# Altium project SB10012_UniversalSlave.PrjPcb
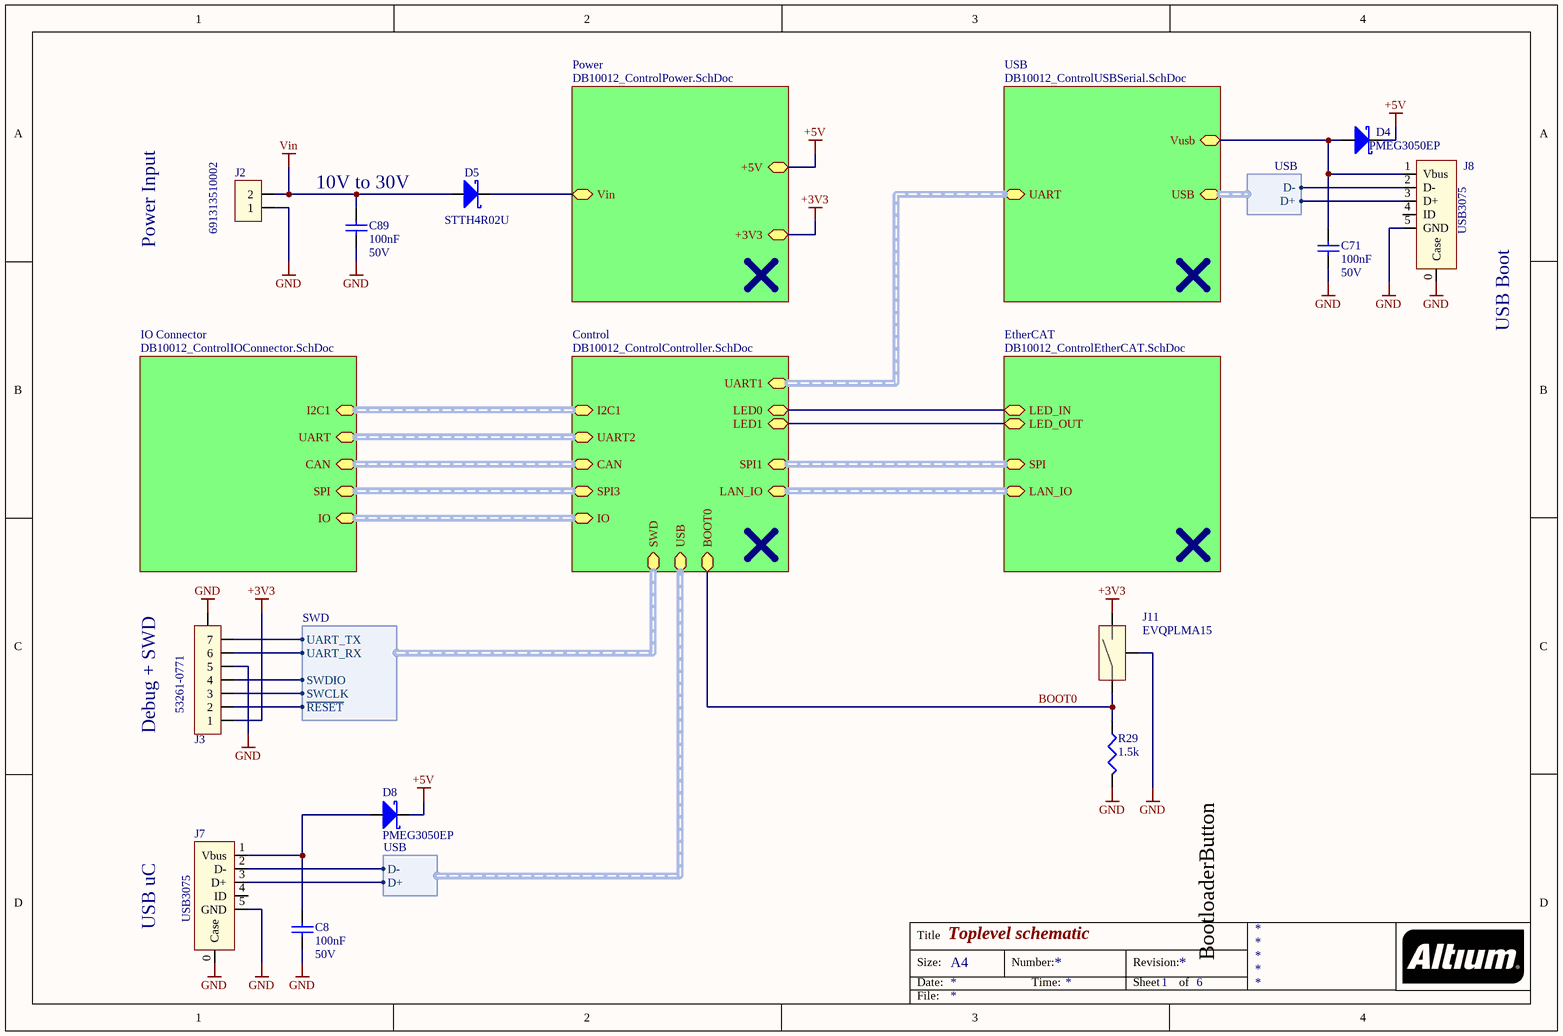
[diagram p0: DB10012_ControlTopLevel.SchDoc]
6 sheets, 148 parts. Net scope: hierarchical (ports join the sheet entries above them; power ports are global).
Board file: DB10012_UniversalSlave.PcbDoc
Sheets:
  DB10012_ControlTopLevel.SchDoc
    EtherCAT = DB10012_ControlEtherCAT.SchDoc
    Control = DB10012_ControlController.SchDoc
    USB = DB10012_ControlUSBSerial.SchDoc
    Power = DB10012_ControlPower.SchDoc
    IO Connector = DB10012_ControlIOConnector.SchDoc

## Sheet DB10012_ControlTopLevel.SchDoc: Toplevel schematic
size A4; SheetNumber: 1; SheetTotal: 6

### Parts
C8  100nF  Voltage Rating: 50V  [C-0805]
C71  100nF  Voltage Rating: 50V  [C-0805]
C89  100nF  Voltage Rating: 50V  [C-0805]
D4  PMEG3050EP  [SOD128]
D5  STTH4R02U  [CASE 403A-03]
D8  PMEG3050EP  [SOD128]
J2  691313510002  [691313510002]
J3  53261-0771  [53261-0771]
J7  USB3075  [USB3075 - NOSLOT]
J8  USB3075  [USB3075 - NOSLOT]
J11  EVQPLMA15  [EVQPLM]
R29  1.5k  [0402]

### Sub-sheets
Control = DB10012_ControlController.SchDoc: SPI1 (harness SPI), LAN_IO (harness LAN_IO), UART1 (harness UART), SPI3 (harness SPI), I2C1 (harness I2C1), CAN (harness CAN), UART2 (harness UART), IO (harness IO), USB (harness USB), SWD (harness SWD), BOOT0, LED0, LED1
EtherCAT = DB10012_ControlEtherCAT.SchDoc: SPI (harness SPI), LAN_IO (harness LAN_IO), LED_IN, LED_OUT
IO Connector = DB10012_ControlIOConnector.SchDoc: SPI (harness SPI), I2C1 (harness I2C1), CAN (harness CAN), IO (harness IO), UART (harness UART)
Power = DB10012_ControlPower.SchDoc: +5V, +3V3, Vin
USB = DB10012_ControlUSBSerial.SchDoc: UART (harness UART), USB (harness USB), Vusb

### Harnesses
SWD: UART_TX, UART_RX, SWDIO, SWCLK, ~{RESET}
USB: D-, D+

### Nets
+3V3: J3.1 J11.2 ; sheet Power/+3V3
+5V: D4.2(K) D8.2(K) ; sheet Power/+5V
GND: C8.1 C71.1 C89.1 J2.1 J3.0(SHLD) J3.5 J7.0(Case) J7.5(GND) J8.0(Case) J8.5(GND) J11.0(GND) R29.1
Vin: C89.2 D5.1(A) J2.2
BOOT0: J11.1 R29.2 ; sheet Control/BOOT0
~{Reset}: J3.2 ; sheet Control/SWD.~{RESET}
SWCLK: J3.3 ; sheet Control/SWD.SWCLK
SWDIO: J3.4 ; sheet Control/SWD.SWDIO
UART1_RX: J3.6 ; sheet Control/SWD.UART_RX
UART1_TX: J3.7 ; sheet Control/SWD.UART_TX
USB_D+: J7.3(D+) ; sheet Control/USB.D+
USB_D-: J7.2(D-) ; sheet Control/USB.D-
NetC2_2: D5.2(K) ; sheet Power/Vin
NetC8_2: C8.2 D8.1(A) J7.1(Vbus)
NetC17_2: C71.2 D4.1(A) J8.1(Vbus) ; sheet USB/Vusb
NetIC5_3: J8.3(D+) ; sheet USB/USB.D+
NetIC5_4: J8.2(D-) ; sheet USB/USB.D-
NetR32_1: sheet EtherCAT/LED_IN, sheet Control/LED0
NetR33_1: sheet EtherCAT/LED_OUT, sheet Control/LED1

Not connected (* = marked no-connect by the designer): J7 4(ID); J8 4(ID)

### Buses and harness runs
harness sheet Control/CAN = sheet IO Connector/CAN
harness sheet Control/I2C1 = sheet IO Connector/I2C1
harness sheet Control/IO = sheet IO Connector/IO
harness sheet Control/LAN_IO = sheet EtherCAT/LAN_IO
harness sheet Control/SPI1 = sheet EtherCAT/SPI
harness sheet Control/SPI3 = sheet IO Connector/SPI
harness sheet Control/UART1 = sheet USB/UART
harness sheet Control/UART2 = sheet IO Connector/UART

### Notes on the sheet
- Power Input
- (near C89) 10V to 30V
- USB Boot
- (near J3) Debug + SWD
- BootloaderButton
- USB uC
- Title
- Size:
- Date:
- A4
- Number:
- Time:
- Revision:
- Sheet
- of
- File:

### Library data of the parts
C8 C71 C89 = 100nF/0805/CER/50V: Capacitor, 100nF, 50V,  X7R; Capacitance Tolerance: ± 10%; Capacitor Case Style: 0805; Brand Number: C0805C104K5RACTU; Brand: KEMET; Dielectric Characteristic: X7R; Capacitance: 100nF; Temperature Range: -55°C to +125°C; Price: 0,022; Order Code Supplier: 1414664; Supplier: Farnell
D4 D8 = PMEG3050EP: Diode Schottky, Vrrm: 30V, If: 3A, Vf: 0.36V; Brand: NXP; Case Style: SOD-128; Forward Current: 5A; Brand Number: PMEG3050EP; Forward Voltage: 0.36V; Order Code Supplier: 1829197; Price: 0,25; Supplier: Farnell; Temperature Range: -55°C to +150°C; Vrrm: 30V
D5 = STTH4R02U: Diode Schottky, Vrrm: 200V, If: 4A, Vf: 1,05V; Brand: STMICROELECTRONICS; Case Style: SMB; Forward Current: 3A; Forward Voltage: 1,05V; Brand Number: STTH4R02U; Order Code Supplier: 1295277; Price: 1,09; Supplier: Farnell; Temperature Range: -65°C to +150°C; Vrrm: 200V
J2 = 691313510002: WR-TBL 313 Series, 2 Contacts, Header, 5.08 mm; Brand: Wurth; Pitch: 5.08mm; Brand Number: 691313510002; Case Style: WR-TBL 313 Series; Order Code Supplier: 1641993; Price: 0,343; Supplier: Farnell
J3 = 53261-0771: PicoBlade 53261 Series, 7Pin, Right Angle; Brand: Molex; Pitch: 1,25mm; Brand Number: 53261-0771; Case Style: 53261-0771; Order Code Supplier: 1125361; Price: 1,80; Supplier: Farnell
J7 J8 = USB3075: USB 2.0 MICRO B, RCPT, 5POS, SMT; Brand: Global Connector Technology; Brand Number: USB3075-30-A; Case Style: Micro B SMT; Pitch: 0.8mm; Order Code Supplier: 2443116; Price: 0,313; Supplier: Farnell
J11 = EVQPLMA15: SWITCH, TACT, 4.9MM, SMD, 2.6N; Brand: PANASONIC ELECTRONIC COMPONENTS; Brand Number: EVQPLMA15; Price: 0,169; Order Code Supplier: 2079484; Supplier: Farnell
R29 = 1.5k/0402/0063W/50V: Resistor, 1.5k, 0.1%, 0.0625W, 50V, 100PPM, 0402; Brand: VISHAY DRALORIC; Brand Number: CRCW04021K50FKED; Power Rating: 0.063W; Case Style: 0402; Order Code Supplier: 2121624; Price: 0,0054; Resistance: 1.5k; Supplier: Farnell; Temperature Coefficient: ± 100PPM; Temperature Range: -55°C to +125°C; Voltage Rating: 50V

## Sheet DB10012_ControlEtherCAT.SchDoc: EtherCAT tranceiver
size A2; SheetNumber: 4; SheetTotal: 6
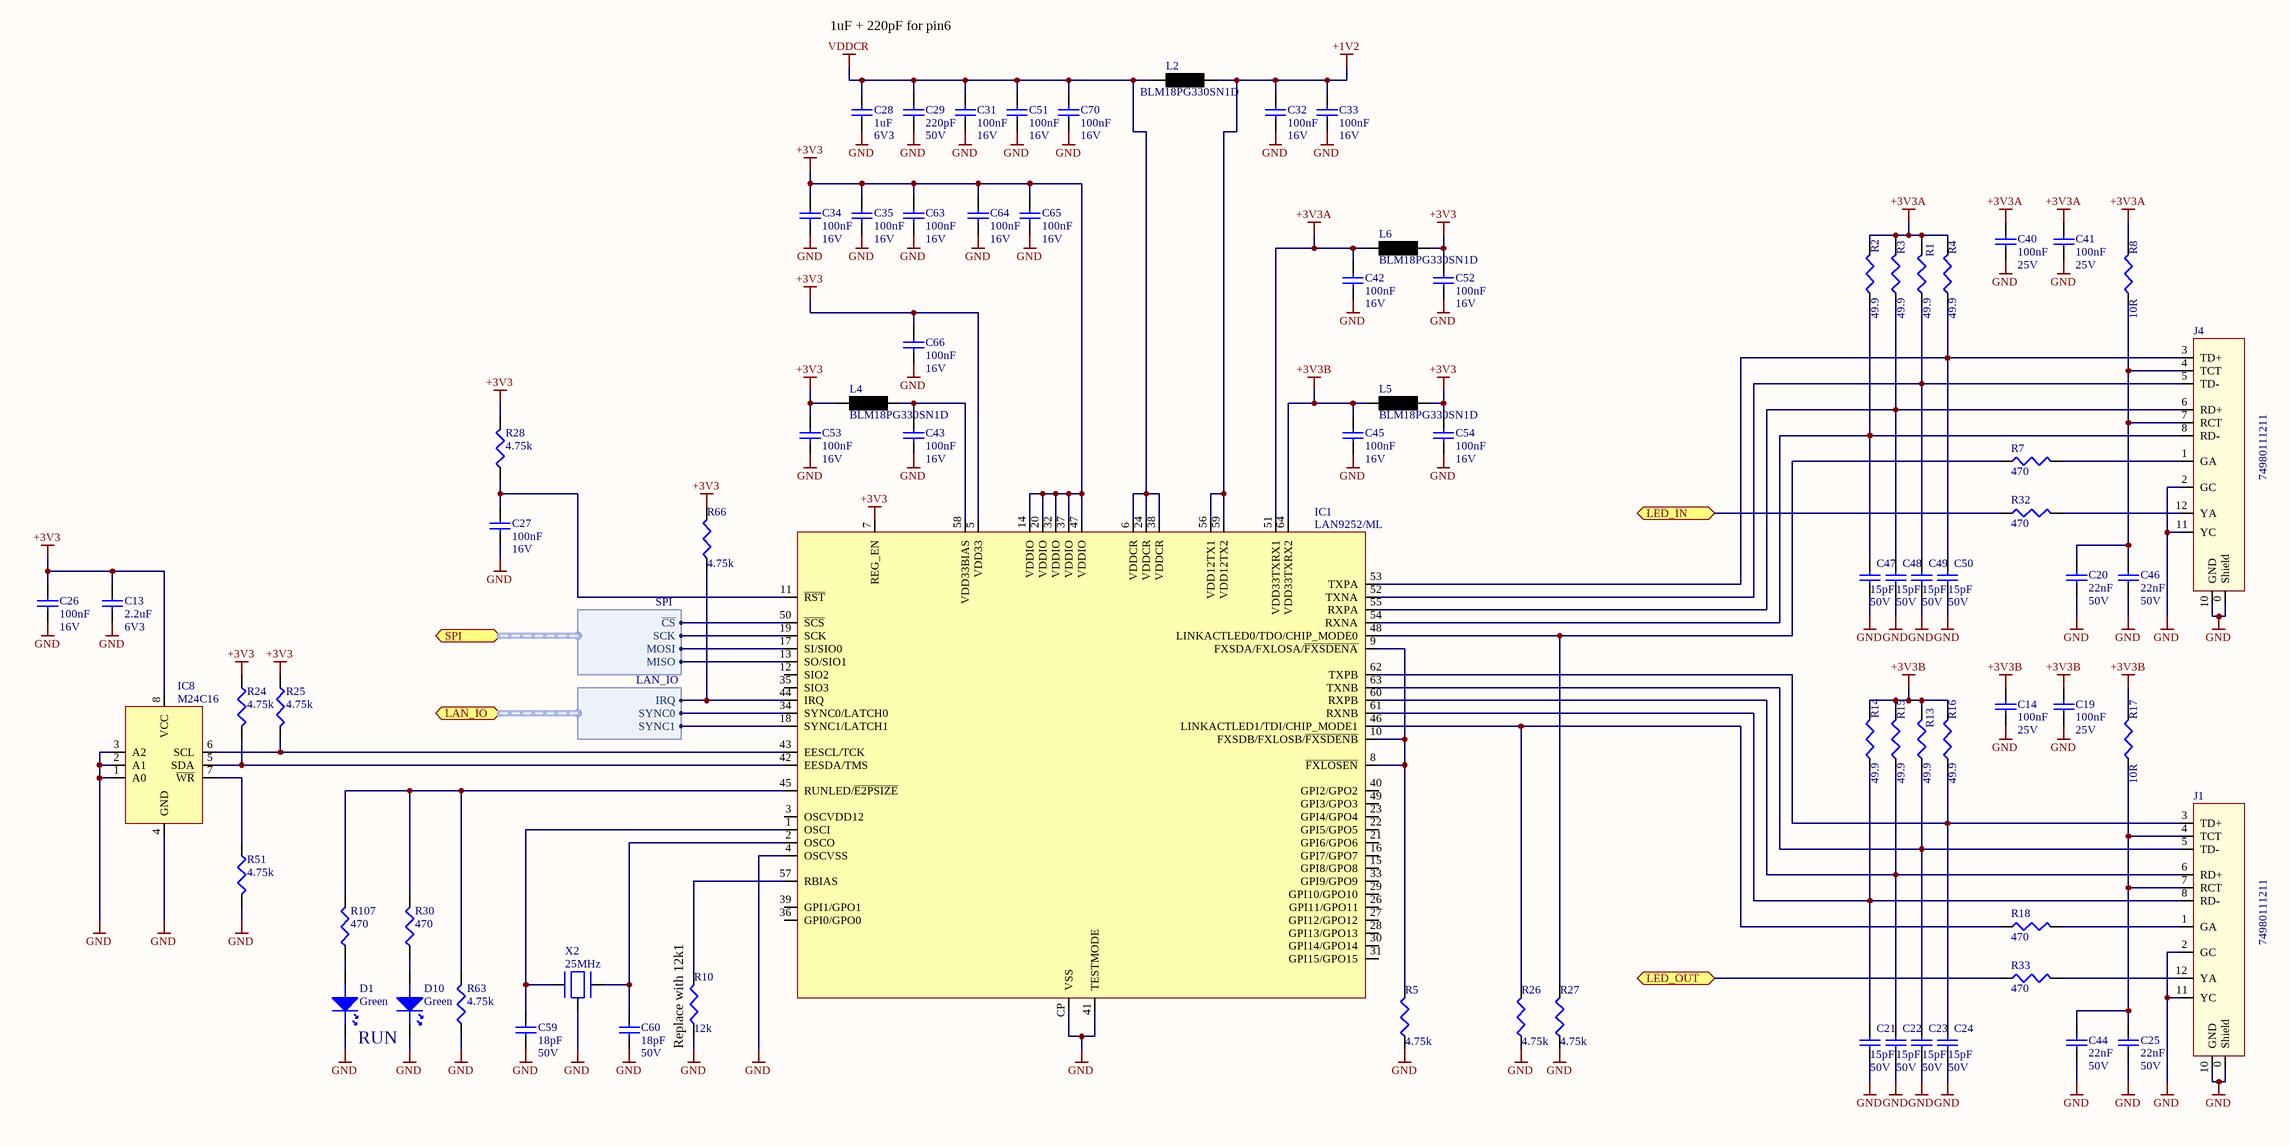
[diagram p1: DB10012_ControlEtherCAT.SchDoc]

### Parts
C13  2.2uF  Voltage Rating: 6V3  [C0402]
C14  100nF  Voltage Rating: 25V  [C0402]
C19  100nF  Voltage Rating: 25V  [C0402]
C20  22nF  Voltage Rating: 50V  [C0402]
C21  15pF  Voltage Rating: 50V  [C0402]
C22  15pF  Voltage Rating: 50V  [C0402]
C23  15pF  Voltage Rating: 50V  [C0402]
C24  15pF  Voltage Rating: 50V  [C0402]
C25  22nF  Voltage Rating: 50V  [C0402]
C26  100nF  Voltage Rating: 16V  [C0402]
C27  100nF  Voltage Rating: 16V  [C0402]
C28  1uF  Voltage Rating: 6V3  [C0402]
C29  220pF  Voltage Rating: 50V  [C0402]
C31  100nF  Voltage Rating: 16V  [C0402]
C32  100nF  Voltage Rating: 16V  [C0402]
C33  100nF  Voltage Rating: 16V  [C0402]
C34  100nF  Voltage Rating: 16V  [C0402]
C35  100nF  Voltage Rating: 16V  [C0402]
C40  100nF  Voltage Rating: 25V  [C0402]
C41  100nF  Voltage Rating: 25V  [C0402]
C42  100nF  Voltage Rating: 16V  [C0402]
C43  100nF  Voltage Rating: 16V  [C0402]
C44  22nF  Voltage Rating: 50V  [C0402]
C45  100nF  Voltage Rating: 16V  [C0402]
C46  22nF  Voltage Rating: 50V  [C0402]
C47  15pF  Voltage Rating: 50V  [C0402]
C48  15pF  Voltage Rating: 50V  [C0402]
C49  15pF  Voltage Rating: 50V  [C0402]
C50  15pF  Voltage Rating: 50V  [C0402]
C51  100nF  Voltage Rating: 16V  [C0402]
C52  100nF  Voltage Rating: 16V  [C0402]
C53  100nF  Voltage Rating: 16V  [C0402]
C54  100nF  Voltage Rating: 16V  [C0402]
C59  18pF  Voltage Rating: 50V  [C0402]
C60  18pF  Voltage Rating: 50V  [C0402]
C63  100nF  Voltage Rating: 16V  [C0402]
C64  100nF  Voltage Rating: 16V  [C0402]
C65  100nF  Voltage Rating: 16V  [C0402]
C66  100nF  Voltage Rating: 16V  [C0402]
C70  100nF  Voltage Rating: 16V  [C0402]
D1  Green  [D-0805]
D10  Green  [D-0805]
IC1  LAN9252/ML  [QFN64_Rect]
IC8  M24C16  [SO-8]
J1  74980111211  [74980111211]
J4  74980111211  [74980111211]
L2  BLM18PG330SN1D  [L0603]
L4  BLM18PG330SN1D  [L0603]
L5  BLM18PG330SN1D  [L0603]
L6  BLM18PG330SN1D  [L0603]
R1  49.9  [0402]
R2  49.9  [0402]
R3  49.9  [0402]
R4  49.9  [0402]
R5  4.75k  [0402]
R7  470  [0402]
R8  10R  [0603]
R10  12k  [0402]
R13  49.9  [0402]
R14  49.9  [0402]
R15  49.9  [0402]
R16  49.9  [0402]
R17  10R  [0603]
R18  470  [0402]
R24  4.75k  [0402]
R25  4.75k  [0402]
R26  4.75k  [0402]
R27  4.75k  [0402]
R28  4.75k  [0402]
R30  470  [0402]
R32  470  [0402]
R33  470  [0402]
R51  4.75k  [0402]
R63  4.75k  [0402]
R66  4.75k  [0402]
R107  470  [0402]
X2  25MHz  [7M]

### Ports
LAN_IO (harness LAN_IO), LED_IN, LED_OUT, SPI (harness SPI)

### Harnesses
SPI: SCK, ~{CS}, MOSI, MISO
LAN_IO: IRQ, SYNC0, SYNC1

### Nets
+1V2: C32.2 C33.2 IC1.56(VDD12TX1) IC1.59(VDD12TX2) L2.2
+3V3: C13.2 C26.2 C34.2 C35.2 C52.2 C53.2 C54.2 C63.2 C64.2 C65.2 C66.2 IC1.5(VDD33) IC1.7(REG_EN) IC1.14(VDDIO) IC1.20(VDDIO) IC1.32(VDDIO) IC1.37(VDDIO) IC1.47(VDDIO) IC8.8(VCC) L4.2 L5.2 L6.2 R24.2 R25.2 R28.2 R66.2
+3V3A: C40.2 C41.2 C42.2 IC1.51(VDD33TXRX1) L6.1 R1.2 R2.2 R3.2 R4.2 R8.2
+3V3B: C14.2 C19.2 C45.2 IC1.64(VDD33TXRX2) L5.1 R13.2 R14.2 R15.2 R16.2 R17.2
GND: C13.1 C14.1 C19.1 C20.1 C21.1 C22.1 C23.1 C24.1 C25.1 C26.1 C27.1 C28.1 C29.1 C31.1 C32.1 C33.1 C34.1 C35.1 C40.1 C41.1 C42.1 C43.1 C44.1 C45.1 C46.1 C47.1 C48.1 C49.1 C50.1 C51.1 C52.1 C53.1 C54.1 C59.1 C60.1 C63.1 C64.1 C65.1 C66.1 C70.1 D1.K D10.K IC1.4(OSCVSS) IC1.41(TESTMODE) IC1.CP(VSS) IC8.1(A0) IC8.2(A1) IC8.3(A2) IC8.4(GND) J1.0(Shield) J1.2(GC) J1.10(GND) J1.11(YC) J4.0(Shield) J4.2(GC) J4.10(GND) J4.11(YC) R5.1 R10.1 R26.1 R27.1 R51.1 R63.1 X2.0
VDDCR: C28.2 C29.2 C31.2 C51.2 C70.2 IC1.6(VDDCR) IC1.24(VDDCR) IC1.38(VDDCR) L2.1
LAN_IRQ: IC1.44(IRQ) R66.1 ; port LAN_IO.IRQ
LAN_SYNC0: IC1.34(SYNC0/LATCH0) ; port LAN_IO.SYNC0
LAN_SYNC1: IC1.18(SYNC1/LATCH1) ; port LAN_IO.SYNC1
SPI1_~{CS}: IC1.50(~{SCS}) ; port SPI.~{CS}
SPI1_MISO: IC1.13(SO/SIO1) ; port SPI.MISO
SPI1_MOSI: IC1.17(SI/SIO0) ; port SPI.MOSI
SPI1_SCK: IC1.19(SCK) ; port SPI.SCK
NetC20_2: C20.2 C46.2 J4.4(TCT) J4.7(RCT) R8.1
NetC21_2: C21.2 IC1.61(RXNB) J1.8(RD-) R14.1
NetC22_2: C22.2 IC1.60(RXPB) J1.6(RD+) R15.1
NetC23_2: C23.2 IC1.63(TXNB) J1.5(TD-) R13.1
NetC24_2: C24.2 IC1.62(TXPB) J1.3(TD+) R16.1
NetC25_2: C25.2 C44.2 J1.4(TCT) J1.7(RCT) R17.1
NetC27_2: C27.2 IC1.11(~{RST}) R28.1
NetC43_2: C43.2 IC1.58(VDD33BIAS) L4.1
NetC47_2: C47.2 IC1.54(RXNA) J4.8(RD-) R2.1
NetC48_2: C48.2 IC1.55(RXPA) J4.6(RD+) R3.1
NetC49_2: C49.2 IC1.52(TXNA) J4.5(TD-) R1.1
NetC50_2: C50.2 IC1.53(TXPA) J4.3(TD+) R4.1
NetC59_2: C59.2 IC1.1(OSCI) X2.1
NetC60_2: C60.2 IC1.2(OSCO) X2.2
NetD1_A: D1.A R107.1
NetD10_A: D10.A R30.1
NetIC1_8: IC1.8(~{FXLOSEN}) IC1.9(FXSDA/FXLOSA/~{FXSDENA}) IC1.10(FXSDB/FXLOSB/~{FXSDENB}) R5.2
NetIC1_42: IC1.42(EESDA/TMS) IC8.5(SDA) R24.1
NetIC1_43: IC1.43(EESCL/TCK) IC8.6(SCL) R25.1
NetIC1_45: IC1.45(RUNLED/~{E2PSIZE}) R30.2 R63.2 R107.2
NetIC1_46: IC1.46(LINKACTLED1/TDI/CHIP_MODE1) R18.1 R26.2
NetIC1_48: IC1.48(LINKACTLED0/TDO/CHIP_MODE0) R7.1 R27.2
NetIC1_57: IC1.57(RBIAS) R10.2
NetIC8_7: IC8.7(~{WR}) R51.2
NetJ1_1: J1.1(GA) R18.2
NetJ1_12: J1.12(YA) R33.2
NetJ4_1: J4.1(GA) R7.2
NetJ4_12: J4.12(YA) R32.2
NetR32_1: R32.1 ; port LED_IN
NetR33_1: R33.1 ; port LED_OUT

Not connected (* = marked no-connect by the designer): IC1 3(OSCVDD12) 12(SIO2) 15(GPI8/GPO8) 16(GPI7/GPO7) 21(GPI6/GPO6) 22(GPI5/GPO5) 23(GPI4/GPO4) 26(GPI11/GPO11) 27(GPI12/GPO12) 28(GPI13/GPO13) 29(GPI10/GPO10) 30(GPI14/GPO14) 31(GPI15/GPO15) 33(GPI9/GPO9) 35(SIO3) 36(GPI0/GPO0) 39(GPI1/GPO1) 40(GPI2/GPO2) 49(GPI3/GPO3)

### Notes on the sheet
- 1uF + 220pF for pin6
- RUN
- (near R10) Replace with 12k1
- Title
- Size:
- Date:
- File:
- A2
- Number:
- Time:
- Revision:
- Sheet
- of

### Library data of the parts
C13 = 2.2uF/0402/CER/6.3V: Capacitor, 2.2uF, 6.3V, X5R; Capacitance Tolerance: ± 10%; Capacitor Case Style: 0402; Brand Number: GRM155R60J225ME15D; Brand: MURATA; Dielectric Characteristic: X5R; Capacitance: 2.2uF; Temperature Range: -55°C to +85°C; Price: 0,818; Order Code Supplier: 2362088; Supplier: Farnell
C14 C19 C40 C41 = 100nF/0402/CER/25V: Capacitor, 100nF, 25V, X7R; Capacitance Tolerance: 10nF; Capacitor Case Style: 0402; Brand Number: GRM155R71E104KE14D; Brand: MULTICOMP; Dielectric Characteristic: X7R; Capacitance: 100nF; Temperature Range: -55 to +125 C; Price: 0,0225; Order Code Supplier: 2456106; Supplier: Farnell
C20 C25 C44 C46 = 22nF/0402/CER/50V: Capacitor, 22nF, 50V, X7R; Capacitance Tolerance: ± 5%; Capacitor Case Style: 0402; Brand Number: GRM155R71H223KA12D; Brand: Murata; Dielectric Characteristic: X7R; Capacitance: 22nF; Temperature Range: -55°C to 125°C; Price: 0,0133; Order Code Supplier: 1828888; Supplier: Farnell
C21-C24 C47-C50 = 15pF/0402/CER/50V: Capacitor, 15pF, 50V, C0G; Capacitance Tolerance: ± 5%; Capacitor Case Style: 0402; Brand Number: GRM1555C1H150JA01D; Brand: Murata; Dielectric Characteristic: C0G; Capacitance: 15pF; Temperature Range: -55°C to 125°C; Price: 0,0097; Order Code Supplier: 2218840; Supplier: Farnell
C26 C27 C31-C35 C42 C43 C45 C51-C54 C63-C66 C70 = 100nF/0402/CER/16V: Capacitor, 100nF, 16V, X7R; Capacitance Tolerance: 10nF; Capacitor Case Style: 0402; Brand Number: GRM155R71C104KA88D; Brand: MURATA; Dielectric Characteristic: X7R; Capacitance: 100nF; Temperature Range: -55 to +125 C; Price: 0,001; Order Code Supplier: 2408523; Supplier: Farnell
C28 = 1uF/0402/CER/6.3V: Capacitor, 1uF, 6.3V, X5R; Capacitance Tolerance: ± 10%; Capacitor Case Style: 0402; Brand Number: 04026D105KAT2A; Brand: AVX; Dielectric Characteristic: X5R; Capacitance: 1uF; Temperature Range: -55°C to +85°C; Price: 0,0874; Order Code Supplier: 1327658; Supplier: Farnell
C29 = 220pF/0402/CER/50V: Capacitor, 220pF, 50V, NP0; Capacitance Tolerance: ± 5%; Capacitor Case Style: 0402; Brand Number: GRM1555C1H221JA01D; Brand: MURATA; Dielectric Characteristic: NP0; Capacitance: 220pF; Temperature Range: -55°C to 125°C; Price: 0,02; Order Code Supplier: 8819580; Supplier: Farnell
C59 C60 = 18pF/0402/CER/50V: Capacitor, 18pF, 50V, NP0; Capacitance Tolerance: ± 5%; Capacitor Case Style: 0402; Brand Number: GRM1555C1H180JA01D; Brand: MURATA; Dielectric Characteristic: NP0; Capacitance: 18pF; Temperature Range: -55°C to 125°C; Price: 0,0177; Order Code Supplier: 1828876; Supplier: Farnell
D1 D10 = KP-2012SGC: Led, Green, Li:12mcd, Vf:2.2V, If:0.02A; Brand: KingBright; Case Style: 0805; Forward Current: 0.02A; Forward Voltage: 2.2V; Luminous Intensity: 12mcd; Brand Number: KP-2012SGC; Order Code Supplier: 1318243; Price: 0,06; Supplier: Farnell; Temperature Range: -30°C to +85°C
IC1 = LAN9252/ML: EtherCAT Slave Controller; Brand: Microchip; Case Style: QFN64; Brand Number: LAN9252/ML; Order Code Supplier: 579-LAN9252/ML; Price: 7,23; Supplier: Mouser; Temperature Range: -55°C to +155°C
IC8 = M24C16-WMN6P: SERIAL EEPROM, 16KBIT, 400KHZ; Brand: ST Micro; Case Style: SO8; Brand Number: M24C16-WMN6P; Order Code Supplier: 9882774; Price: 0,811; Supplier: Farnell; Temperature Range: -55°C to +155°C
J1 J4 = 74980111211: RJ45 With LAN TRANSFRMR; Brand: Wurth; Case Style: SMT RJ45; Brand Number: 74980111211; Order Code Supplier: 2407403; Pitch: -; Price: 9,36; Supplier: Farnell
L2 L4-L6 = BLM18PG330SN1D: Ferrite Bead, Impedance:33ohm, DC Resistance Max:0.025ohm, DC Current Rating:3A; Brand: MURATA; Case Style: 0603; Brand Number: BLM18PG330SN1D; Order Code Supplier: 1515742; Price: 0,048; Supplier: Farnell
R1-R4 R13-R16 = 49.9/0402/0063W/50V: Resistor, 49.9, 0.1%, 0.0625W, 50V, 100PPM, 0402; Brand: VISHAY DRALORIC; Brand Number: CRCW040249R9FKED; Power Rating: 0.063W; Case Style: 0402; Order Code Supplier: 2121437; Price: 0,0004; Resistance: 49.9; Supplier: Farnell; Temperature Coefficient: ± 100PPM; Temperature Range: -55°C to +125°C; Voltage Rating: 50V
R5 R24-R28 R51 R63 R66 = 4.75k/0402/0063W/50V: Resistor, 4.75k, 0.1%, 0.0625W, 50V, 100PPM, 0402; Brand: VISHAY DRALORIC; Brand Number: CRCW04024K75FKED; Power Rating: 0.063W; Case Style: 0402; Order Code Supplier: 2121689; Price: 0,0006; Resistance: 4.75k; Supplier: Farnell; Temperature Coefficient: ± 100PPM; Temperature Range: -55°C to +125°C; Voltage Rating: 50V
R7 R18 R30 R32 R33 R107 = 470/0402/0063W/50V: Resistor, 470, 1%, 0.0625W, 50V, 100PPM, 0402; Brand: VISHAY DRALORIC; Brand Number: CRG0402F470R; Power Rating: 0.063W; Case Style: 0402; Order Code Supplier: 2331533; Price: 0,0099; Resistance: 470; Supplier: Farnell; Temperature Coefficient: ± 100PPM; Temperature Range: -55°C to +125°C; Voltage Rating: 50V
R8 R17 = 10/0603/0125W/50V: Resistor, 10R, 1%, 0.125W, 50V, 200PPM, 0603; Brand: MULTICOMP; Brand Number: MCHP03W8F100JT5E; Case Style: 0603; Order Code Supplier: 1576250; Power Rating: 0.125W; Price: 0,08; Resistance: 10R; Supplier: Farnell; Temperature Coefficient: ± 200PPM; Temperature Range: -55°C to +155°C; Voltage Rating: 50V
R10 = 12k/0402/0063W/50V: Resistor, 12k, 1%, 0.0625W, 50V, 100PPM, 0402; Brand: TE CONNECTIVITY; Brand Number: CRG0402F12K; Power Rating: 0.063W; Case Style: 0402; Order Code Supplier: 2331453; Price: 0,0075; Resistance: 12k; Supplier: Farnell; Temperature Coefficient: ± 100PPM; Temperature Range: -55°C to +125°C; Voltage Rating: 50V
X2 = 7M-25.000MAAJ-T: CRYSTAL, 25MHz,18PF CL, 3.2X2.5MM SMT; Brand: TXC; Price: 0,995; Supplier: Farnell; Order Code Supplier: 1842068; Brand Number: 7M-25.000MAAJ-T

## Sheet DB10012_ControlController.SchDoc: Microcontroller
size A3; SheetNumber: 5; SheetTotal: 6
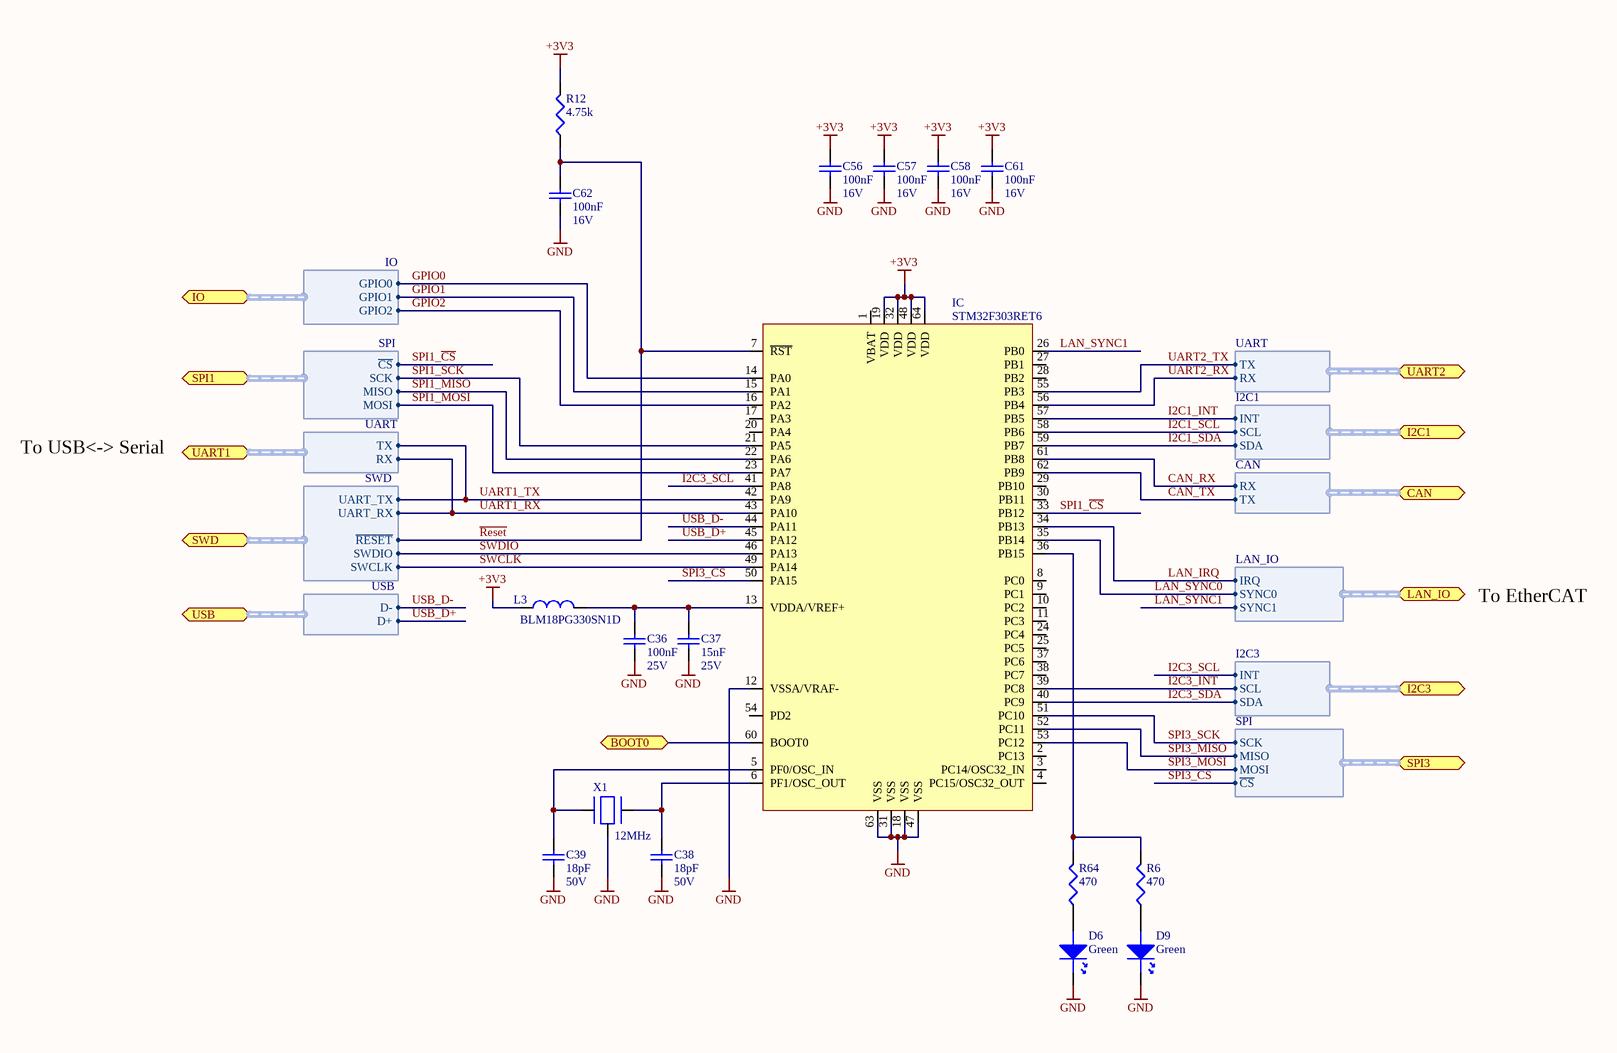
[diagram p2: DB10012_ControlController.SchDoc]

### Parts
C36  100nF  Voltage Rating: 25V  [C0402]
C37  15nF  Voltage Rating: 25V  [C0402]
C38  18pF  Voltage Rating: 50V  [C0402]
C39  18pF  Voltage Rating: 50V  [C0402]
C56  100nF  Voltage Rating: 16V  [C0402]
C57  100nF  Voltage Rating: 16V  [C0402]
C58  100nF  Voltage Rating: 16V  [C0402]
C61  100nF  Voltage Rating: 16V  [C0402]
C62  100nF  Voltage Rating: 16V  [C0402]
D6  Green  [D-0805]
D9  Green  [D-0805]
IC  STM32F303RET6  [LQFP64]
L3  BLM18PG330SN1D  [L0603]
R6  470  [0402]
R12  4.75k  [0402]
R64  470  [0402]
X1  12MHz  [7M]

### Ports
BOOT0, CAN (harness CAN), I2C1 (harness I2C1), I2C3 (harness I2C3), IO (harness IO), LAN_IO (harness LAN_IO), SPI1 (harness SPI), SPI3 (harness SPI), SWD (harness SWD), UART1 (harness UART), UART2 (harness UART), USB (harness USB)

### Harnesses
SWD: UART_TX, UART_RX, SWDIO, SWCLK, ~{RESET}
SPI: SCK, ~{CS}, MOSI, MISO
LAN_IO: IRQ, SYNC0, SYNC1
UART: TX, RX
USB: D-, D+
CAN: TX, RX
I2C1: INT, SCL, SDA
IO: GPIO0, GPIO1, GPIO2
I2C3: INT, SCL, SDA

### Nets
+3V3: C56.2 C57.2 C58.2 C61.2 IC.19(VDD) IC.32(VDD) IC.48(VDD) IC.64(VDD) L3.2 R12.2
GND: C36.1 C37.1 C38.1 C39.1 C56.1 C57.1 C58.1 C61.1 C62.1 D6.K D9.K IC.12(VSSA/VRAF-) IC.18(VSS) IC.31(VSS) IC.47(VSS) IC.63(VSS) X1.0
BOOT0: IC.60(BOOT0) ; port BOOT0
CAN_RX: IC.61(PB8) ; port CAN.RX
CAN_TX: IC.62(PB9) ; port CAN.TX
GPIO0: IC.14(PA0) ; port IO.GPIO0
GPIO1: IC.15(PA1) ; port IO.GPIO1
GPIO2: IC.16(PA2) ; port IO.GPIO2
I2C1_INT: IC.57(PB5) ; port I2C1.INT
I2C1_SCL: IC.58(PB6) ; port I2C1.SCL
I2C1_SDA: IC.59(PB7) ; port I2C1.SDA
I2C3_INT: IC.39(PC8) ; port I2C3.SCL
I2C3_SCL: IC.41(PA8) ; port I2C3.INT
I2C3_SDA: IC.40(PC9) ; port I2C3.SDA
LAN_IRQ: IC.34(PB13) ; port LAN_IO.IRQ
LAN_SYNC0: IC.35(PB14) ; port LAN_IO.SYNC0
LAN_SYNC1: IC.26(PB0) ; port LAN_IO.SYNC1
~{Reset}: C62.2 IC.7(~{RST}) R12.1 ; port SWD.~{RESET}
SPI1_~{CS}: IC.33(PB12) ; port SPI1.~{CS}
SPI1_MISO: IC.22(PA6) ; port SPI1.MISO
SPI1_MOSI: IC.23(PA7) ; port SPI1.MOSI
SPI1_SCK: IC.21(PA5) ; port SPI1.SCK
SPI3_~{CS}: IC.50(PA15) ; port SPI3.~{CS}
SPI3_MISO: IC.52(PC11) ; port SPI3.MISO
SPI3_MOSI: IC.53(PC12) ; port SPI3.MOSI
SPI3_SCK: IC.51(PC10) ; port SPI3.SCK
SWCLK: IC.49(PA14) ; port SWD.SWCLK
SWDIO: IC.46(PA13) ; port SWD.SWDIO
UART1_RX: IC.43(PA10) ; port SWD.UART_RX, port UART1.RX
UART1_TX: IC.42(PA9) ; port SWD.UART_TX, port UART1.TX
UART2_RX: IC.56(PB4) ; port UART2.RX
UART2_TX: IC.55(PB3) ; port UART2.TX
USB_D+: IC.45(PA12) ; port USB.D+
USB_D-: IC.44(PA11) ; port USB.D-
NetC36_2: C36.2 C37.2 IC.13(VDDA/VREF+) L3.1
NetC38_2: C38.2 IC.6(PF1/OSC_OUT) X1.1
NetC39_2: C39.2 IC.5(PF0/OSC_IN) X1.2
NetD6_A: D6.A R64.1
NetD9_A: D9.A R6.1
NetIC_36: IC.36(PB15) R6.2 R64.2

Not connected (* = marked no-connect by the designer): IC 1(VBAT) 2(PC13) 3(PC14/OSC32_IN) 4(PC15/OSC32_OUT) 8(PC0) 9(PC1) 10(PC2) 11(PC3) 17(PA3) 20(PA4) 24(PC4) 25(PC5) 27(PB1) 28(PB2) 29(PB10) 30(PB11) 37(PC6) 38(PC7) 54(PD2)

### Notes on the sheet
- To USB<-> Serial
- To EtherCAT
- Title
- Size:
- Date:
- A3
- Number:
- Time:
- Revision:
- Sheet
- of
- File:

### Library data of the parts
C36 = 100nF/0402/CER/25V: as C14 on sheet DB10012_ControlEtherCAT; Dielectric Characteristic: X7R; Capacitance: 100nF; Temperature Range: -55 to +125 C; Price: 0,0225; Order Code Supplier: 2456106; Supplier: Farnell
C37 = 15nF/0402/CER/25V: Capacitor, 15nF, 25V, X7R; Capacitance Tolerance: +/-10%; Capacitor Case Style: 0402; Brand Number: GRM155R71E153KA61D; Brand: Murata; Dielectric Characteristic: X7R; Capacitance: 15nF; Temperature Range: -55°C to 125°C; Price: 0,0267; Order Code Supplier: 2470470; Supplier: Farnell
C38 C39 = 18pF/0402/CER/50V: as C59 on sheet DB10012_ControlEtherCAT; Dielectric Characteristic: NP0; Capacitance: 18pF; Temperature Range: -55°C to 125°C; Price: 0,0177; Order Code Supplier: 1828876; Supplier: Farnell
C56-C58 C61 C62 = 100nF/0402/CER/16V: as C26 on sheet DB10012_ControlEtherCAT; Dielectric Characteristic: X7R; Capacitance: 100nF; Temperature Range: -55 to +125 C; Price: 0,001; Order Code Supplier: 2408523; Supplier: Farnell
D6 D9 = KP-2012SGC: as D1 on sheet DB10012_ControlEtherCAT; Brand Number: KP-2012SGC; Order Code Supplier: 1318243; Price: 0,06; Supplier: Farnell; Temperature Range: -30°C to +85°C
IC = STM32F303RET6: ARM Cortex-M4, 72 MHz, 512 KB, 64 KB, 64; Brand: STM; Brand Number: STM32F303RET6; Supplier: Farnell; Order Code Supplier: 2466939
L3 = BLM18PG330SN1D: as L2 on sheet DB10012_ControlEtherCAT; Brand Number: BLM18PG330SN1D; Price: 0,048; Supplier: Farnell; Order Code Supplier: 1515742
R6 R64 = 470/0402/0063W/50V: as R7 on sheet DB10012_ControlEtherCAT; Case Style: 0402; Order Code Supplier: 2331533; Price: 0,0099; Resistance: 470; Supplier: Farnell; Temperature Coefficient: ± 100PPM; Temperature Range: -55°C to +125°C; Voltage Rating: 50V
R12 = 4.75k/0402/0063W/50V: as R5 on sheet DB10012_ControlEtherCAT; Case Style: 0402; Order Code Supplier: 2121689; Price: 0,0006; Resistance: 4.75k; Supplier: Farnell; Temperature Coefficient: ± 100PPM; Temperature Range: -55°C to +125°C; Voltage Rating: 50V
X1 = 7M-12.000MAAJ-T: CRYSTAL, 12MHz,18PF CL, 3.2X2.5MM SMT; Brand: TXC; Order Code Supplier: 1842056; Price: 1,45; Supplier: Farnell; Brand Number: 7M-12.000MAAJ-T

## Sheet DB10012_ControlUSBSerial.SchDoc: USB to serial
size A4; SheetNumber: 3; SheetTotal: 6
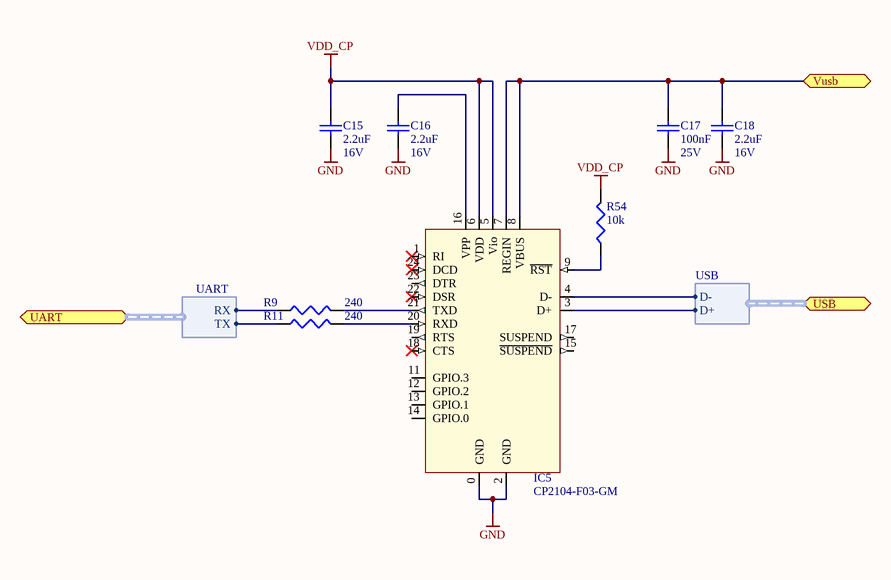
[diagram p3: DB10012_ControlUSBSerial.SchDoc]

### Parts
C15  2.2uF  Voltage Rating: 16V  [C0603]
C16  2.2uF  Voltage Rating: 16V  [C0603]
C17  100nF  Voltage Rating: 25V  [C0402]
C18  2.2uF  Voltage Rating: 16V  [C0603]
IC5  CP2104-F03-GM  [QFN24]
R9  240  [0402]
R11  240  [0402]
R54  10k  [0402]

### Ports
UART (harness UART), USB (harness USB), Vusb

### Harnesses
UART: RX, TX
USB: D-, D+

### Nets
GND: C15.1 C16.1 C17.1 C18.1 IC5.0(GND) IC5.2(GND)
VDD_CP: C15.2 IC5.5(Vio) IC5.6(VDD) R54.2
UART1_RX: R9.1 ; port UART.RX
UART1_TX: R11.1 ; port UART.TX
NetC16_2: C16.2 IC5.16(VPP)
NetC17_2: C17.2 C18.2 IC5.7(REGIN) IC5.8(VBUS) ; port Vusb
NetIC5_3: IC5.3(D+) ; port USB.D+
NetIC5_4: IC5.4(D-) ; port USB.D-
NetIC5_9: IC5.9(~{RST}) R54.1
NetIC5_20: IC5.20(RXD) R11.2
NetIC5_21: IC5.21(TXD) R9.2

Not connected (* = marked no-connect by the designer): IC5 1(RI)* 11(GPIO.3) 12(GPIO.2) 13(GPIO.1) 14(GPIO.0) 15(~{SUSPEND}) 17(SUSPEND) 18(CTS)* 19(RTS) 22(DSR)* 23(DTR) 24(DCD)*

### Notes on the sheet
- Title
- Size:
- Date:
- A4
- Number:
- Time:
- Revision:
- Sheet
- of
- File:

### Library data of the parts
C15 C16 C18 = 2.2uF/0603/CER/16V: Capacitor, 2.2uF, 16V, X5R; Capacitance Tolerance: +/- 10%; Capacitor Case Style: 0603; Brand Number: GRM188R61C225KE15D; Brand: MURATA; Dielectric Characteristic: X5R; Capacitance: 2.2uF; Temperature Range: -55°C to 85°C; Price: 0,077; Order Code Supplier: 1735526; Supplier: Farnell
C17 = 100nF/0402/CER/25V: as C14 on sheet DB10012_ControlEtherCAT; Dielectric Characteristic: X7R; Capacitance: 100nF; Temperature Range: -55 to +125 C; Price: 0,0225; Order Code Supplier: 2456106; Supplier: Farnell
IC5 = CP2104-F03-GM: USB to UART converter; Case Style: QFN24; Price: 1,65; Order Code Supplier: 757-4983; Brand Number: CP2104-F03-GM; Supplier: RS-Components
R9 R11 = 240/0402/0063W/50V: Resistor, 240, 0.1%, 0.0625W, 50V, 100PPM, 0402; Brand: VISHAY DRALORIC; Brand Number: CRCW0402240RFKED; Power Rating: 0.063W; Case Style: 0402; Order Code Supplier: 2121522; Price: 0,0006; Resistance: 240; Supplier: Farnell; Temperature Coefficient: ± 100PPM; Temperature Range: -55°C to +125°C; Voltage Rating: 50V
R54 = 10k/0402/0063W/50V: Resistor, 10k, 0.1%, 0.0625W, 50V, 100PPM, 0402; Brand: VISHAY DRALORIC; Brand Number: CRCW040210K0FKED; Power Rating: 0.063W; Case Style: 0402; Order Code Supplier: 2121730; Price: 0,0005; Resistance: 10k; Supplier: Farnell; Temperature Coefficient: ± 100PPM; Temperature Range: -55°C to +125°C; Voltage Rating: 50V

## Sheet DB10012_ControlPower.SchDoc: Power supply
size A4; SheetNumber: 2; SheetTotal: 6
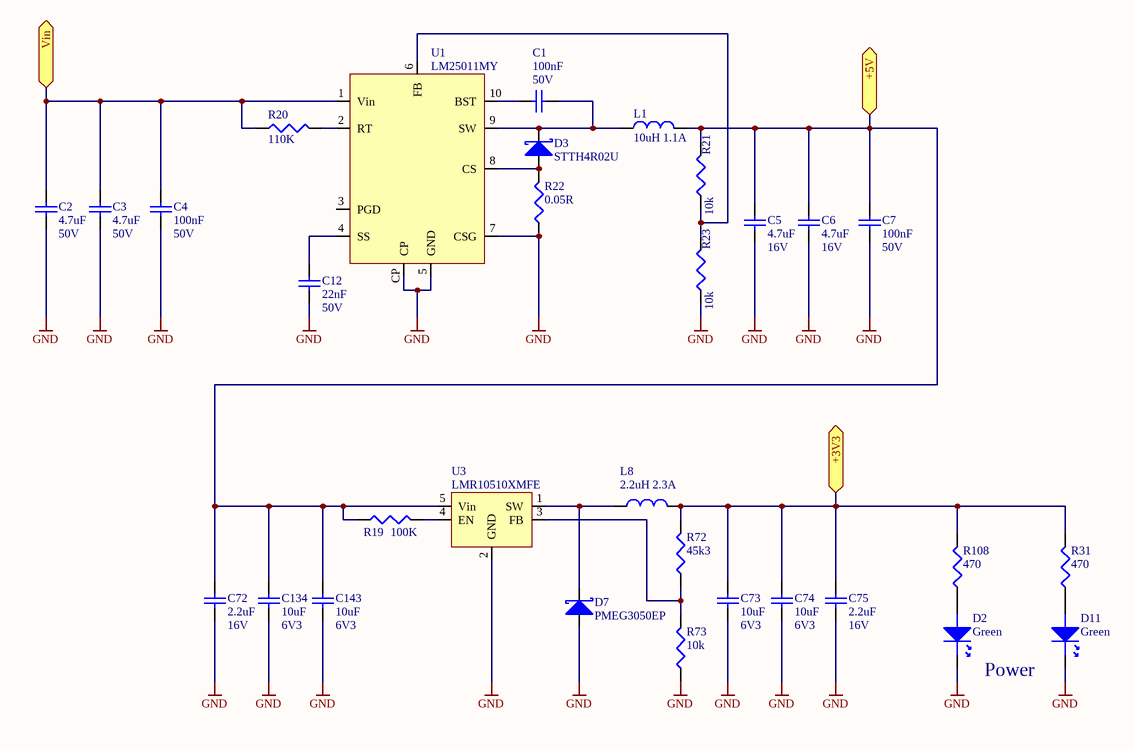
[diagram p4: DB10012_ControlPower.SchDoc]

### Parts
C1  100nF  Voltage Rating: 50V  [C-0805]
C2  4.7uF  Voltage Rating: 50V  [C-1206]
C3  4.7uF  Voltage Rating: 50V  [C-1206]
C4  100nF  Voltage Rating: 50V  [C-0805]
C5  4.7uF  Voltage Rating: 16V  [C-0805]
C6  4.7uF  Voltage Rating: 16V  [C-0805]
C7  100nF  Voltage Rating: 50V  [C-0805]
C12  22nF  Voltage Rating: 50V  [C0402]
C72  2.2uF  Voltage Rating: 16V  [C0603]
C73  10uF  Voltage Rating: 6V3  [C0603]
C74  10uF  Voltage Rating: 6V3  [C0603]
C75  2.2uF  Voltage Rating: 16V  [C0603]
C134  10uF  Voltage Rating: 6V3  [C-0805]
C143  10uF  Voltage Rating: 6V3  [C-0805]
D2  Green  [D-0805]
D3  STTH4R02U  [CASE 403A-03]
D7  PMEG3050EP  [SOD128]
D11  Green  [D-0805]
L1  10uH 1.1A  [WE-TPC 5818, L]
L8  2.2uH 2.3A  [SRN2512]
R19  100K  [0402]
R20  110K  [0603]
R21  10k  [0402]
R22  0.05R  [0805]
R23  10k  [0402]
R31  470  [0402]
R72  45k3  [0402]
R73  10k  [0402]
R108  470  [0402]
U1  LM25011MY  [MUC10A]
U3  LMR10510XMFE  [SOT-23-5]

### Ports
+3V3, +5V, Vin

### Nets
+3V3: C73.1 C74.1 C75.2 L8.1 R31.2 R72.2 R108.2 ; port +3V3
+5V: C5.2 C6.2 C7.2 C72.2 C134.1 C143.1 L1.2 R19.1 R21.2 U3.5(Vin) ; port +5V
GND: C2.1 C3.1 C4.1 C5.1 C6.1 C7.1 C12.1 C72.1 C73.2 C74.2 C75.1 C134.2 C143.2 D2.K D7.1(A) D11.K R22.1 R23.1 R73.1 U1.5(GND) U1.7(CSG) U1.CP U3.2(GND)
NetC1_1: C1.1 U1.10(BST)
NetC1_2: C1.2 D3.2(K) L1.1 U1.9(SW)
NetC2_2: C2.2 C3.2 C4.2 R20.1 U1.1(Vin) ; port Vin
NetC12_2: C12.2 U1.4(SS)
NetD2_A: D2.A R108.1
NetD3_1: D3.1(A) R22.2 U1.8(CS)
NetD7_2: D7.2(K) L8.0 U3.1(SW)
NetD11_A: D11.A R31.1
NetR19_2: R19.2 U3.4(EN)
NetR20_2: R20.2 U1.2(RT)
NetR21_1: R21.1 R23.2 U1.6(FB)
NetR72_1: R72.1 R73.2 U3.3(FB)

Not connected (* = marked no-connect by the designer): U1 3(PGD)

### Notes on the sheet
- Power
- Title
- Size:
- Date:
- A4
- Number:
- Time:
- Revision:
- Sheet
- of
- File:

### Library data of the parts
C1 C4 C7 = 100nF/0805/CER/50V: as C8 on sheet DB10012_ControlTopLevel; Dielectric Characteristic: X7R; Capacitance: 100nF; Temperature Range: -55°C to +125°C; Price: 0,022; Order Code Supplier: 1414664; Supplier: Farnell
C2 C3 = 4.7uF/1206/CER/50V: Capacitor, 4.7uF, 50V, X7R; Capacitance Tolerance: ± 10%; Capacitor Case Style: 1206; Brand Number: 12065D475KAT2A; Brand: AVX; Dielectric Characteristic: X7R; Capacitance: 4.7uF; Temperature Range: -55°C to +125°C; Price: 0.371; Order Code Supplier: 2332884; Supplier: Farnell
C5 C6 = 4.7uF/0805/CER/16V: Capacitor, 4.7uF, 16V, X7R; Capacitance Tolerance: ± 10%; Capacitor Case Style: 0805; Brand Number: GRM21BR71C475KA73L; Brand: MURATA; Dielectric Characteristic: X7R; Capacitance: 4.7uF; Temperature Range: -55°C to +125°C; Price: 0,26; Order Code Supplier: 1797015; Supplier: Farnell
C12 = 22nF/0402/CER/50V: as C20 on sheet DB10012_ControlEtherCAT; Dielectric Characteristic: X7R; Capacitance: 22nF; Temperature Range: -55°C to 125°C; Price: 0,0133; Order Code Supplier: 1828888; Supplier: Farnell
C72 C75 = 2.2uF/0603/CER/16V: as C15 on sheet DB10012_ControlUSBSerial; Dielectric Characteristic: X5R; Capacitance: 2.2uF; Temperature Range: -55°C to 85°C; Price: 0,077; Order Code Supplier: 1735526; Supplier: Farnell
C73 C74 = 10uF/0603/CER/6V3/X5R: Capacitor, 10uF, 6.3V, X5R; Capacitance Tolerance: ± 20%; Brand Number: GRM188R60J106ME47D; Brand: MURATA; Capacitance: 10uF; Dielectric Characteristic: X5R; Capacitor Case Style: C0603; Temperature Range: -55°C to +85°C; Price: 0,117; Order Code Supplier: 1735528; Supplier: Farnell
C134 C143 = 10uF/0805/CER/6V3: Capacitor, 10uF, 6.3V, X7R; Capacitance Tolerance: ± 10%; Capacitor Case Style: 0805; Brand Number: GRM21BR70J106KE76L; Brand: MURATA; Dielectric Characteristic: X7R; Capacitance: 10uF; Temperature Range: -55°C to +125°C; Price: 0,22; Order Code Supplier: 1845768; Supplier: Farnell
D2 D11 = KP-2012SGC: as D1 on sheet DB10012_ControlEtherCAT; Brand Number: KP-2012SGC; Order Code Supplier: 1318243; Price: 0,06; Supplier: Farnell; Temperature Range: -30°C to +85°C
D3 = STTH4R02U: as D5 on sheet DB10012_ControlTopLevel; Brand Number: STTH4R02U; Order Code Supplier: 1295277; Price: 1,09; Supplier: Farnell; Temperature Range: -65°C to +150°C; Vrrm: 200V
D7 = PMEG3050EP: as D4 on sheet DB10012_ControlTopLevel; Brand Number: PMEG3050EP; Forward Voltage: 0.36V; Order Code Supplier: 1829197; Price: 0,25; Supplier: Farnell; Temperature Range: -55°C to +150°C; Vrrm: 30V
L1 = 744052100: 10UH, 30%, 1.1A; Brand: Wurth; Case Style: WE-PD 5818; DC Resistance: 0.13ohm; Brand Number: 744052100; DC Current: 1.1A; Inductance: 10uH; Order Code Supplier: 1635854; Price: 1,36; Q Factor: *; Supplier: Farnell; Temperature Range: -40°C to +125°C
L8 = SRN2512-2R2M: 2.2UH, 20%, 2.3A; Brand: BOURNS; DC Resistance: 0.1ohm; Inductance: 2.2 uH; Brand Number: SRN2512-2R2M; Case Style: SRN2512; DC Current: 2.3A; Order Code Supplier: 2428203; Price: 0,354; Q Factor: *; Supplier: Farnell; Temperature Range: -40°C to +125°C
R19 = 100k/0402/0063W/50V: Resistor, 100k, 0.1%, 0.0625W, 50V, 100PPM, 0402; Brand: VISHAY DRALORIC; Brand Number: CRCW0402100KFKED; Power Rating: 0.063W; Case Style: 0402; Order Code Supplier: 2121857; Price: 0,0004; Resistance: 100K; Supplier: Farnell; Temperature Coefficient: ± 100PPM; Temperature Range: -55°C to +125°C; Voltage Rating: 50V
R20 = 110K/0603/0100W/75V: Resistor, 110K, 0.1%, 0.1W, 75V, 25PPM, 0603; Brand: VISHAY DRALORIC; Brand Number: CRCW0603110KFKEA; Case Style: 0603; Order Code Supplier: 2122623; Power Rating: 0.1W; Price: 0,51; Resistance: 110K; Supplier: Farnell; Temperature Coefficient: ± 25PPM; Temperature Range: -55°C to +155°C; Voltage Rating: 75V
R21 R23 R73 = 10k/0402/0063W/50V: as R54 on sheet DB10012_ControlUSBSerial; Case Style: 0402; Order Code Supplier: 2121730; Price: 0,0005; Resistance: 10k; Supplier: Farnell; Temperature Coefficient: ± 100PPM; Temperature Range: -55°C to +125°C; Voltage Rating: 50V
R22 = 0.05/0805/0125W/150V: Resistor, 0.05R, 1%, 0.125W, 150V, 100PPM, 0805; Brand: PANASONIC; Brand Number: ERJL06KF50MV; Case Style: 0805; Order Code Supplier: 1577552; Power Rating: 0.125W; Price: 0,64; Resistance: 0.05R; Supplier: Farnell; Temperature Coefficient: ± 100PPM; Temperature Range: -55°C to +125°C; Voltage Rating: 150V
R31 R108 = 470/0402/0063W/50V: as R7 on sheet DB10012_ControlEtherCAT; Case Style: 0402; Order Code Supplier: 2331533; Price: 0,0099; Resistance: 470; Supplier: Farnell; Temperature Coefficient: ± 100PPM; Temperature Range: -55°C to +125°C; Voltage Rating: 50V
R72 = 45k3/0402/0063W/50V: Resistor, 45K3, 0.1%, 0.0625W, 50V, 100PPM, 0402; Brand: VISHAY DRALORIC; Brand Number: CRCW040245K3FKED; Power Rating: 0.063W; Case Style: 0402; Order Code Supplier: 2121812; Price: 0,0054; Resistance: 45k3; Supplier: Farnell; Temperature Coefficient: ± 100PPM; Temperature Range: -55°C to +125°C; Voltage Rating: 50V
U1 = LM25011MY: STEP-DOWN REGULATOR, MSOP-10; Brand: TEXAS INSTRUMENTS; Brand Number: LM25011MY/NOPB; Case Style: MSOP10; Current: 2A; Vout: Adj; Vin-min: 6V; Vin-max: 42V; Order Code Supplier: 2102674; Price: 2,26; Supplier: Farnell; Temperature Range: -40°C to +85°C
U3 = LMR10510XMFE: DC/DC CONV, BUCK, 1.95MHZ, SOT-23-5; Brand: TEXAS INSTRUMENTS; Brand Number: LMR10510XMFE/NOPB; Current: 0.3A; Vout: Adj; Vin-min: 3V; Vin-max: 5.5V; Case Style: SOT-23-5; Order Code Supplier: 2436300; Price: 0,54; Supplier: Farnell; Temperature Range: -40°C to +85°C

## Sheet DB10012_ControlIOConnector.SchDoc: Header layour - TODO
size A4; SheetNumber: 6; SheetTotal: 6
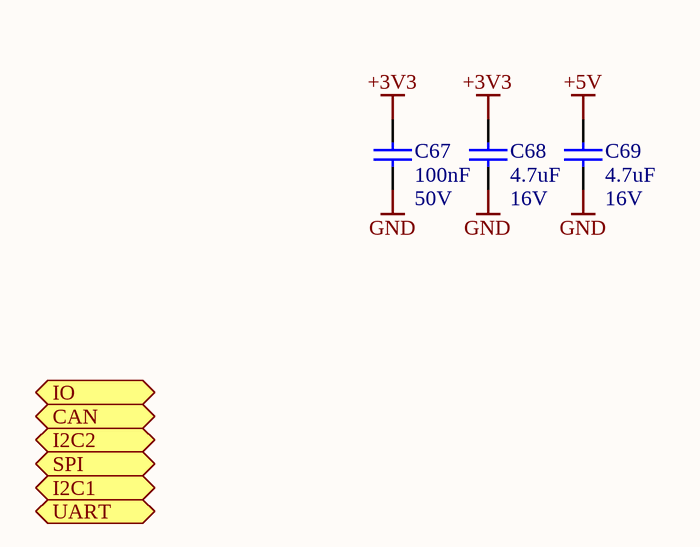
[diagram p5: DB10012_ControlIOConnector.SchDoc]

### Parts
C67  100nF  Voltage Rating: 50V  [C-0805]
C68  4.7uF  Voltage Rating: 16V  [C-0805]
C69  4.7uF  Voltage Rating: 16V  [C-0805]

### Ports
CAN (harness CAN), I2C1 (harness I2C1), I2C2 (harness I2C3), IO (harness IO), SPI (harness SPI), UART (harness UART)

### Nets
+3V3: C67.2 C68.2
+5V: C69.2
GND: C67.1 C68.1 C69.1

### Notes on the sheet
- Title
- Size:
- Date:
- A4
- Number:
- Time:
- Revision:
- Sheet
- of
- File:

### Library data of the parts
C67 = 100nF/0805/CER/50V: as C8 on sheet DB10012_ControlTopLevel; Dielectric Characteristic: X7R; Capacitance: 100nF; Temperature Range: -55°C to +125°C; Price: 0,022; Order Code Supplier: 1414664; Supplier: Farnell
C68 C69 = 4.7uF/0805/CER/16V: as C5 on sheet DB10012_ControlPower; Dielectric Characteristic: X7R; Capacitance: 4.7uF; Temperature Range: -55°C to +125°C; Price: 0,26; Order Code Supplier: 1797015; Supplier: Farnell

## Nets that join several sheets
+3V3: DB10012_ControlTopLevel (J3.1 J11.2), DB10012_ControlEtherCAT (26 pins), DB10012_ControlController (10 pins), DB10012_ControlPower (7 pins), DB10012_ControlIOConnector (C67.2 C68.2)
+5V: DB10012_ControlTopLevel (D4.2 D8.2), DB10012_ControlPower (10 pins), DB10012_ControlIOConnector (C69.2)
GND: DB10012_ControlTopLevel (12 pins), DB10012_ControlEtherCAT (64 pins), DB10012_ControlController (17 pins), DB10012_ControlUSBSerial (6 pins), DB10012_ControlPower (23 pins), DB10012_ControlIOConnector (C67.1 C68.1 C69.1)
BOOT0: DB10012_ControlTopLevel (J11.1 R29.2), DB10012_ControlController (IC.60)
LAN_IRQ: DB10012_ControlEtherCAT (IC1.44 R66.1), DB10012_ControlController (IC.34)
LAN_SYNC0: DB10012_ControlEtherCAT (IC1.34), DB10012_ControlController (IC.35)
LAN_SYNC1: DB10012_ControlEtherCAT (IC1.18), DB10012_ControlController (IC.26)
NetC2_2: DB10012_ControlTopLevel (D5.2), DB10012_ControlPower (5 pins)
NetC17_2: DB10012_ControlTopLevel (C71.2 D4.1 J8.1), DB10012_ControlUSBSerial (C17.2 C18.2 IC5.7 IC5.8)
NetIC5_3: DB10012_ControlTopLevel (J8.3), DB10012_ControlUSBSerial (IC5.3)
NetIC5_4: DB10012_ControlTopLevel (J8.2), DB10012_ControlUSBSerial (IC5.4)
~{Reset}: DB10012_ControlTopLevel (J3.2), DB10012_ControlController (C62.2 IC.7 R12.1)
SPI1_~{CS}: DB10012_ControlEtherCAT (IC1.50), DB10012_ControlController (IC.33)
SPI1_MISO: DB10012_ControlEtherCAT (IC1.13), DB10012_ControlController (IC.22)
SPI1_MOSI: DB10012_ControlEtherCAT (IC1.17), DB10012_ControlController (IC.23)
SPI1_SCK: DB10012_ControlEtherCAT (IC1.19), DB10012_ControlController (IC.21)
SWCLK: DB10012_ControlTopLevel (J3.3), DB10012_ControlController (IC.49)
SWDIO: DB10012_ControlTopLevel (J3.4), DB10012_ControlController (IC.46)
UART1_RX: DB10012_ControlTopLevel (J3.6), DB10012_ControlController (IC.43), DB10012_ControlUSBSerial (R9.1)
UART1_TX: DB10012_ControlTopLevel (J3.7), DB10012_ControlController (IC.42), DB10012_ControlUSBSerial (R11.1)
USB_D+: DB10012_ControlTopLevel (J7.3), DB10012_ControlController (IC.45)
USB_D-: DB10012_ControlTopLevel (J7.2), DB10012_ControlController (IC.44)